# Altium schematic sheet Sheet1.SchDoc
size A
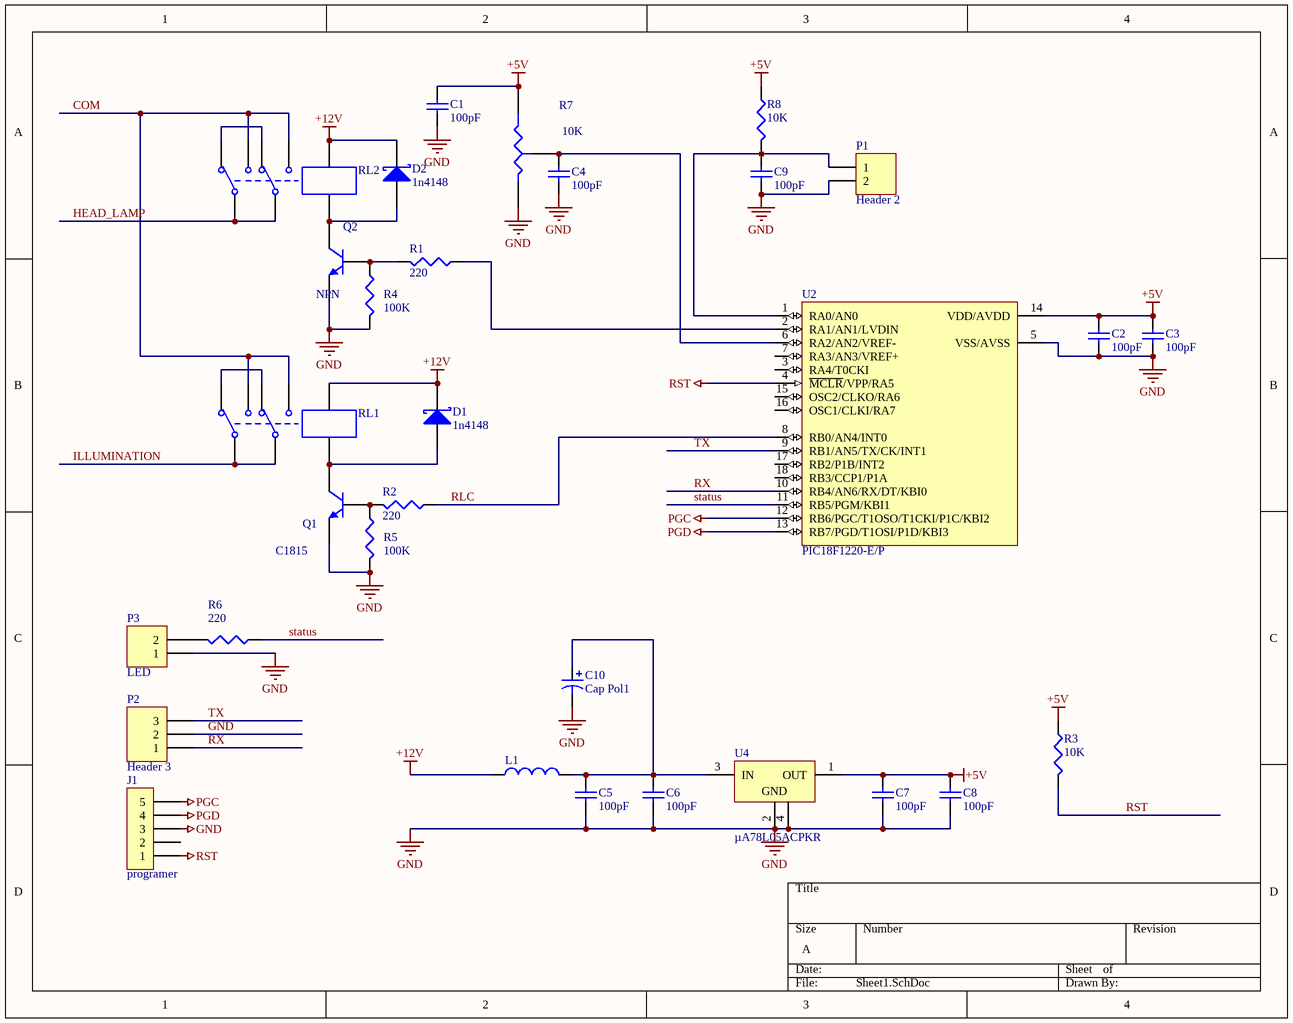
[diagram p0: Sheet1.SchDoc]

## Parts
C1  value 100pF  [RESC2012L]  (hidden comment: Cap Semi)
C2  value 100pF  [RESC2012L]  (hidden comment: Cap Semi)
C3  value 100pF  [RESC2012L]  (hidden comment: Cap Semi)
C4  value 100pF  [RESC2012L]  (hidden comment: Cap Semi)
C5  value 100pF  [RESC2012L]  (hidden comment: Cap Semi)
C6  value 100pF  [RESC2012L]  (hidden comment: Cap Semi)
C7  value 100pF  [RESC2012L]  (hidden comment: Cap Semi)
C8  value 100pF  [RESC2012L]  (hidden comment: Cap Semi)
C9  value 100pF  [RESC2012L]  (hidden comment: Cap Semi)
C10  Cap Pol1  [CAP5]
D1  1n4148  [MELF-D5022-2009]
D2  1n4148  [MELF-D5022-2009]
J1  programer  [HDR1x5]
L1  (no value)  [INDC3216]
P1  Header 2  [HDR1X2]
P2  Header 3  [HDR1X3]
P3  LED  [HDR1X2]
Q1  C1815  [SOT-23B]
Q2  NPN  [SOT-23B]
R1  value 220  [RESC2012L]  (hidden comment: Res3)
R2  value 220  [RESC2012L]  (hidden comment: Res3)
R3  value 10K  [RESC2012L]  (hidden comment: Res3)
R4  value 100K  [RESC2012L]  (hidden comment: Res3)
R5  value 100K  [RESC2012L]  (hidden comment: Res3)
R6  value 220  [RESC2012L]  (hidden comment: Res3)
R7  value 10K  [VR_V_MH]  (hidden comment: Res Tap)
R8  value 10K  [RESC2012L]  (hidden comment: Res3)
RL1  Relay-DPDT  [RELAY_8PIN_MH]  (value not drawn)
RL2  Relay-DPDT  [RELAY_8PIN_MH]  (value not drawn)
U2  PIC18F1220-E/P  [PDIP300-P18]
U4  µA78L05ACPKR  [PK03]

## Nets
+5V: C1.2 C2.2 C3.2 C7.2 C8.2 R3.1 R7.2(B) R8.1 U2.14(VDD/AVDD) U4.1(OUT)
+12V: D1.2(K) D2.2(K) L1.1 RL1.8 RL2.8
GND: C1.1 C2.1 C3.1 C4.1 C5.1 C6.1 C7.1 C8.1 C9.1 C10.2 J1.3 P1.2 P2.2 P3.1 Q1.3(E) Q2.3(E) R4.2 R5.2 R7.1(A) U2.5(VSS/AVSS) U4.2(GND) U4.4(GND)
PGC: J1.5 U2.12(RB6/PGC/T1OSO/T1CKI/P1C/KBI2)
PGD: J1.4 U2.13(RB7/PGD/T1OSI/P1D/KBI3)
RST: J1.1 R3.2 U2.4(~{MCLR}/VPP/RA5)
COM: RL1.3 RL1.6 RL2.3 RL2.6
HEAD_LAMP: RL2.1 RL2.4
ILLUMINATION: RL1.1 RL1.4
RLC: R2.1 U2.8(RB0/AN4/INT0)
RX: P2.1 U2.10(RB4/AN6/RX/DT/KBI0)
status: R6.1 U2.11(RB5/PGM/KBI1)
TX: P2.3 U2.9(RB1/AN5/TX/CK/INT1)
NetC4_2: C4.2 R7.3(TAP) U2.6(RA2/AN2/VREF-)
NetC5_2: C5.2 C6.2 C10.1 L1.2 U4.3(IN)
NetC9_2: C9.2 P1.1 R8.2 U2.1(RA0/AN0)
NetD1_1: D1.1(A) Q1.1(C) RL1.7
NetD2_1: D2.1(A) Q2.1(C) RL2.7
NetP3_2: P3.2 R6.2
NetQ1_2: Q1.2(B) R2.2 R5.1
NetQ2_2: Q2.2(B) R1.2 R4.1
NetR1_1: R1.1 U2.2(RA1/AN1/LVDIN)
NetRL1_2: RL1.2 RL1.5
NetRL2_2: RL2.2 RL2.5

Not connected (* = marked no-connect by the designer): J1 2; U2 3(RA4/T0CKI) 7(RA3/AN3/VREF+) 15(OSC2/CLKO/RA6) 16(OSC1/CLKI/RA7) 17(RB2/P1B/INT2) 18(RB3/CCP1/P1A)

## Library data of the parts
C1-C9 = Cap Semi: Capacitor (Semiconductor SIM Model); Published: 8-Jun-2000; LatestRevisionDate: 29-May-2009; LatestRevisionNote: IPC-7351 Footprint Added.; PackageReference: C1206; Publisher: Altium Limited; PackageDescription: Chip Capacitor
C10 = Cap Pol1: Polarized Capacitor (Radial); Value: 100pF; Published: 8-Jun-2000; LatestRevisionDate: 17-Jul-2002; LatestRevisionNote: Re-released for DXP Platform.; PackageReference: RB7.6-15; Publisher: Altium Limited; PackageDescription: Polarized Capacitor (Radial); 2 Leads
D1 D2 = 1N4148_SMD: Schottky Diode; Published: 8-Jun-2000; LatestRevisionDate: 17-Jul-2002; LatestRevisionNote: Re-released for DXP Platform.; PackageReference: SMB; Publisher: Altium Limited; PackageDescription: DO-214-AA/SMB; 2 C-Bend Leads; Body 5.3 x 3.6 mm, inc. leads (LxW); Code_JEDEC: DO-214-AA
J1 = CON5: Connector
L1 = Inductor: Code_IEC: 1005; Value: 10mH; Published: 8-Jun-2000; LatestRevisionDate: 29-May-2009; LatestRevisionNote: IPC-7351 Footprint Added.; PackageReference: 0402-A; Publisher: Altium Limited; PackageDescription: Chip Inductor; Code_JEITA: 0402
P1 P3 = Header 2: Header, 2-Pin; LatestRevisionDate: 17-Jul-2002; LatestRevisionNote: Re-released for DXP Platform.; Publisher: Altium Limited
P2 = Header 3: Header, 3-Pin; LatestRevisionDate: 17-Jul-2002; LatestRevisionNote: Re-released for DXP Platform.; Publisher: Altium Limited
Q1 Q2 = NPN: NPN Bipolar Transistor; Published: 8-Jun-2000; LatestRevisionDate: 17-Jul-2002; LatestRevisionNote: Re-released for DXP Platform.; PackageReference: TO-226-AA; Publisher: Altium Limited; PackageDescription: TO, Flat Index; 3 In-Line, Axial Leads; Body Dia. 4.8mm; Leads 0.55 x 0.51 mm (max); Code_JEDEC: TO-226-AA
R1-R6 R8 = Res3: Resistor; Published: 8-Jun-2000; LatestRevisionDate: 29-May-2009; LatestRevisionNote: IPC-7351 Footprint Added.; PackageReference: J1-0603; Publisher: Altium Limited; PackageDescription: Chip Resistor
R7 = Res Tap: Tapped Resistor; Sim Note: Enter the Resistance value and the set point into parameter fields.; Set Position: 0.5; Published: 24-Mar-1999; LatestRevisionDate: 17-Jul-2002; LatestRevisionNote: Re-released for DXP Platform.; PackageReference: VR3; Publisher: Altium Limited; PackageDescription: Variable Resistor, Thru-Hole; 3 Leads
RL1 RL2 = Relay-DPDT: Dual-Pole Dual-Throw Relay; Published: 24-Mar-1999; LatestRevisionDate: 17-Jul-2002; LatestRevisionNote: Re-released for DXP Platform.; PackageReference: DIP-P8; Publisher: Altium Limited; PackageDescription: Relay; 8 Leads
U2 = PIC18F1220-E/P: High Performance, Enhanced Flash Microcontroller with 10-Bit A/D and nanoWatt Technology, 4K Flash, 18-Pin PDIP, Extended Temperature; Published: 11-Oct-2004; LatestRevisionDate: 29-Jan-2009; LatestRevisionNote: Sch. layout revised. 3D Model Removed.; DatasheetVersion: revF, Feb-2007; PackageVersion: revBB, Aug-2009; PackageReference: PDIP300-P18; Publisher: Altium Limited; PackageDescription: 18-Lead Plastic Dual In-Line (P) - 300 mil Body [PDIP]; Supplier 1: Digi-Key; Supplier Part Number 1: PIC18F1220-E/P-ND; Supplier 2: Farnell; Supplier Part Number 2: 1579595; Code_JEDEC: MS-001; ComponentLink1Description: Datasheet; ComponentLink1URL: http://ww1.microchip.com/downloads/en/DeviceDoc/39605F.pdf; ComponentLink2Description: Packaging Specification; ComponentLink2URL: http://www.microchip.com/stellent/groups/techpub_sg/documents/packagingspec/en012702.pdf; ComponentLink3Description: Microchip.com Home; ComponentLink3URL: http://www.microchip.com/
U4 = µA78L05ACPKR: Positive-Voltage Regulator; Note: Pin 2 is electrically connected to TAB.; Published: 15-Apr-2002; DatasheetVersion: Jul-2000; PackageVersion: Oct-1994; PackageReference: PK03; Publisher: Altium Limited; PackageDescription: SOT-89; Body 4.6 x 4.25 mm, inc. leads (LxW max); Code_JEDEC: TO-243-AA; Code_IPC: SOT 89; ComponentLink1Description: Manufacturer Link; ComponentLink1URL: http://www.ti.com/; ComponentLink2Description: Datasheet; ComponentLink2URL: http://www-s.ti.com/sc/ds/ua78l05a.pdf